# EAGLE design pump (EAGLE 9.0.1)
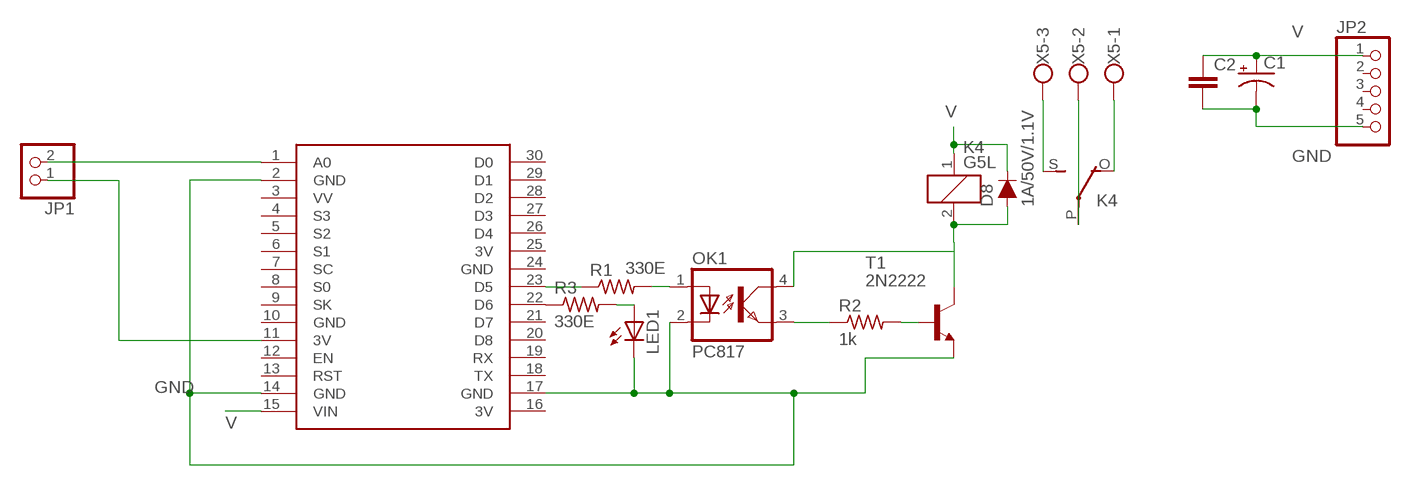
[diagram p0: schematic, sheet 1]

## Parts
C1  CPOL-USE5-5  [E5-5]
C2  C5/3  [C5B3]
D8  1A/50V/1.1V  DIODE-PTH  [DIODE-1N4001]
JP1  PINHD-1X2  [1X02]
JP2  PINHD-1X5  [1X05]
K4  G5L  [G5LE]
LED1  LED5MM  [LED5MM]
OK1  PC817  [DIL04]
R1  330E  R-US_0204/7  [0204/7]
R2  1k  R-US_0207/7  [0207/7]
R3  330E  R-US_0204/7  [0204/7]
T1  2N2222  [TO92-EBC-OVAL]
U$1  NODEMCU  [NODEMCU]
X5  W237-103  [W237-103]

## Nets
GND: C1.- C2.2 JP2.5 LED1.K(C) OK1.2(C) T1.E U$1.2(GND) U$1.14(GND) U$1.17(GND)
N$1: R1.1 U$1.23(D5)
N$2: OK1.1(A) R1.2
N$3: OK1.3(EMIT) R2.1
N$4: R2.2 T1.B
N$5: LED1.A R3.2
N$6: JP1.2 U$1.1(A0)
N$7: JP1.1 U$1.11(3V)
N$8: R3.1 U$1.22(D6)
N$39: K4.S(2:S) X5.3
N$40: K4.O(2:O) X5.1
N$41: K4.P(2:P) X5.2
N$42: D8.A K4.2 OK1.4(COL) T1.C
V: C1.+ C2.1 D8.C JP2.1 K4.1 U$1.15(VIN)
Unconnected: JP2.2 JP2.3 JP2.4 U$1.3(VV) U$1.4(S3) U$1.5(S2) U$1.6(S1) U$1.7(SC) U$1.8(S0) U$1.9(SK) U$1.12(EN) U$1.13(RST) U$1.18(TX) U$1.19(RX) U$1.20(D8) U$1.21(D7) U$1.26(D4) U$1.27(D3) U$1.28(D2) U$1.29(D1) U$1.30(D0)

## Power pins joined to a net without a drawn wire
3V: U$1.16(3V) U$1.25(3V)
GND: U$1.10(GND) U$1.24(GND)

## Library data of the parts
C1 = adafruit:CPOL-US: POLARIZED CAPACITOR, American symbol
C2 = capacitor-wima:C: CAPACITOR naming: grid - package width
D8 = SparkFun-DiscreteSemi:DIODE: Diode These are standard reverse protection diodes and small signal diodes. SparkFun Products: SparkFun SparkPunk Sound Kit <https://www.sparkfun.com/products/11177> SparkFun ESP8266 Thing <https://www.sparkfun.com/products/13231>; PROD_ID: DIO-09176
JP1 = DC_LOAD_AU:PINHD-1X2: PIN HEADER
JP2 = pinhead:PINHD-1X5: PIN HEADER
K4 = relay:G5L: RELAY 1 x switch, 10 A/120 V AC, 8 A/30 V ADC, Omron; OC_FARNELL: unknown; OC_NEWARK: unknown
LED1 = adafruit:LED: LED OSRAM: - CHIPLED LG R971, LG N971, LY N971, LG Q971, LY Q971, LO R971, LY R971 LH N974, LH R974 LS Q976, LO Q976, LY Q976 LO Q996 - Hyper CHIPLED LW Q18S LB Q993, LB Q99A, LB R99A - SideLED LS A670, LO A670, LY A670, LG A670, LP A670 LB A673, LV A673, LT A673, LW A673 LH A674 LY A675 LS A676, LA A676, LO A676, LY A676, LW A676 LS A679, LY A679, LG A679 - Hyper Micro SIDELED® LS Y876, LA Y876, LO Y876, LY Y876 LT Y87S - SmartLED LW L88C, LW L88S LB L89C, LB L89S, LG L890 LS L89K, LO L89K, LY L89K LS L896, LA L896, LO L896, LY L896 - TOPLED LS T670, LO T670, LY T670, LG T670, LP T670 LSG T670, LSP T670, LSY T670, LOP T670, LYG T670 LG T671, LOG T671, LSG T671 LB T673, LV T673, LT T673, LW T673 LH T674 LS T676, LA T676, LO T676, LY T676, LB T676, LH T676, LSB T676, LW T676 LB T67C, LV T67C, LT T67C, LS T67K, LO T67K, LY T67K, LW E67C LS E67B, LA E67B, LO E67B, LY E67B, LB E67C, LV E67C, LT E67C LW T67C LS T679, LY T679, LG T679 LS T770, LO T770, LY T770, LG T770, LP T770 LB T773, LV T773, LT T773, LW T773 LH T774 LS E675, LA E675, LY E675, LS T675 LS T776, LA T776, LO T776, LY T776, LB T776 LHGB T686 LT T68C, LB T68C - Hyper Mini TOPLED® LB M676 - Mini TOPLED Santana® LG M470 LS M47K, LO M47K, LY M47K Source: http://www.osram.convergy.de/
OK1 = optocoupler:PC817: SHARP OPTO COUPLER; MPN: PC817X4J000F; OC_FARNELL: 9707727; OC_NEWARK: 97K7059
R1-R3 = adafruit:R-US_: RESISTOR, American symbol
T1 = adafruit:2N2222: NPN TRANSISTOR Big oval pads
U$1 = nodemcu:NODEMCU
X5 = con-wago-500:W237-103: WAGO SCREW CLAMP; MPN: 237-103; OC_FARNELL: unknown; OC_NEWARK: 18M7116

## Board
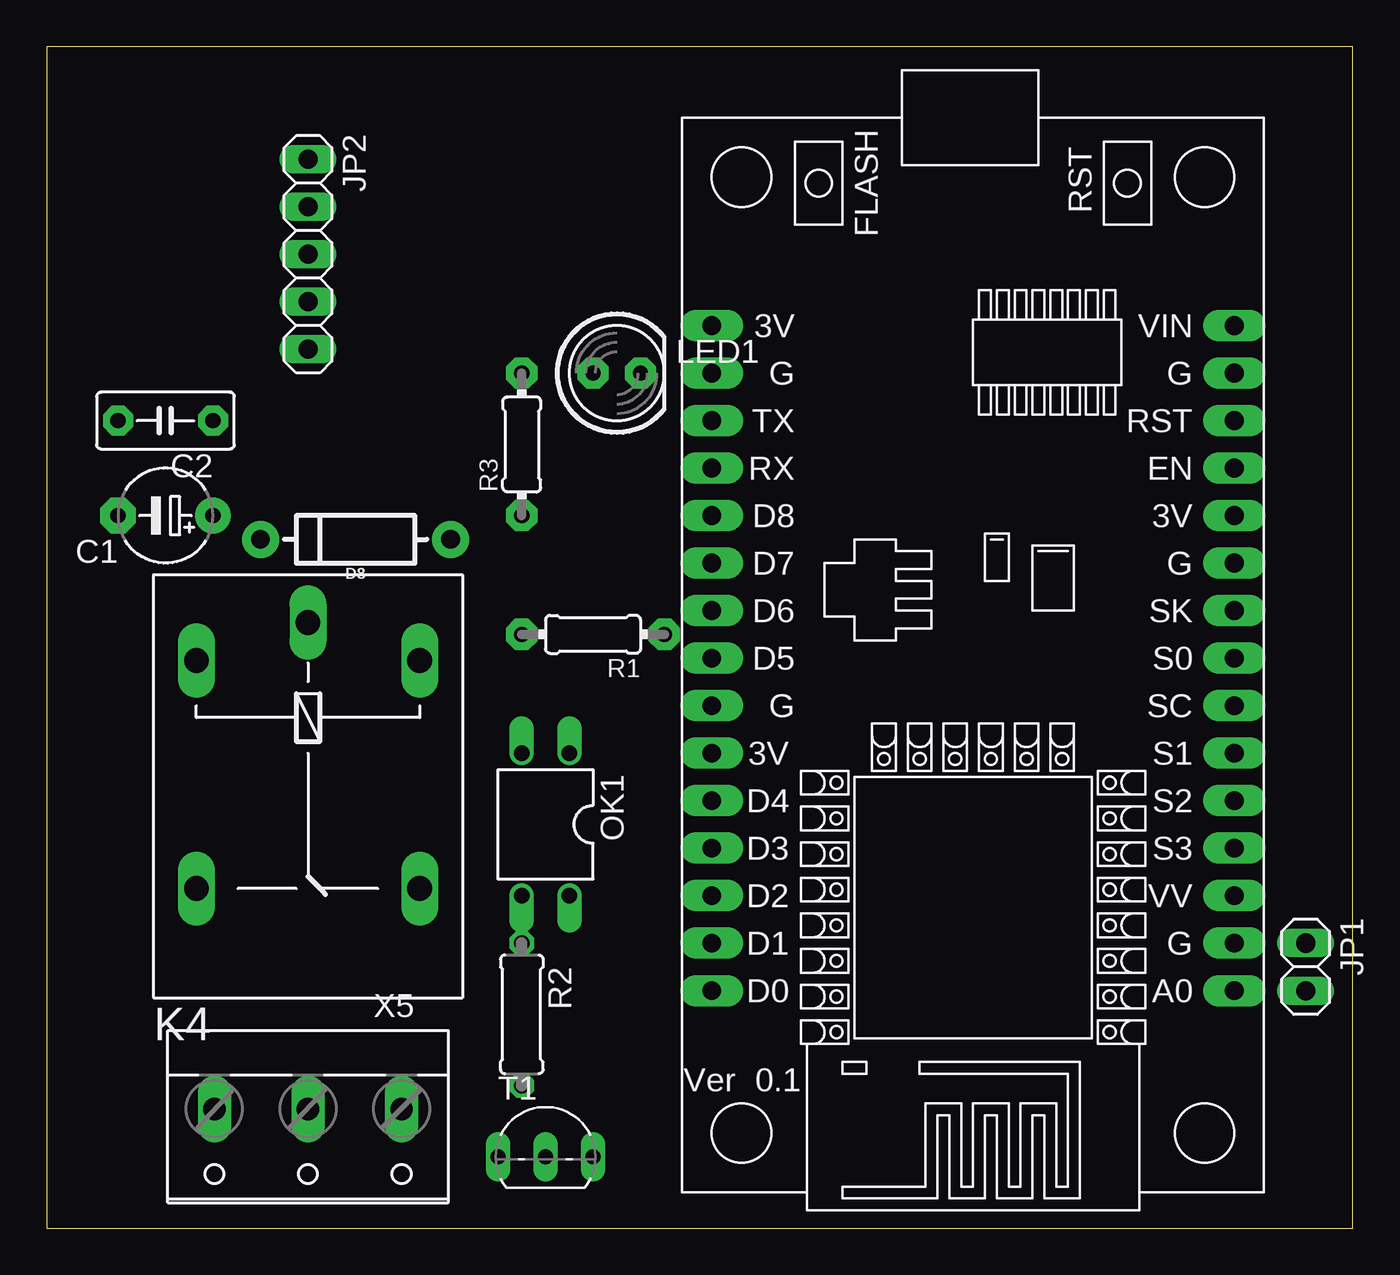
[diagram p1: board, top side]
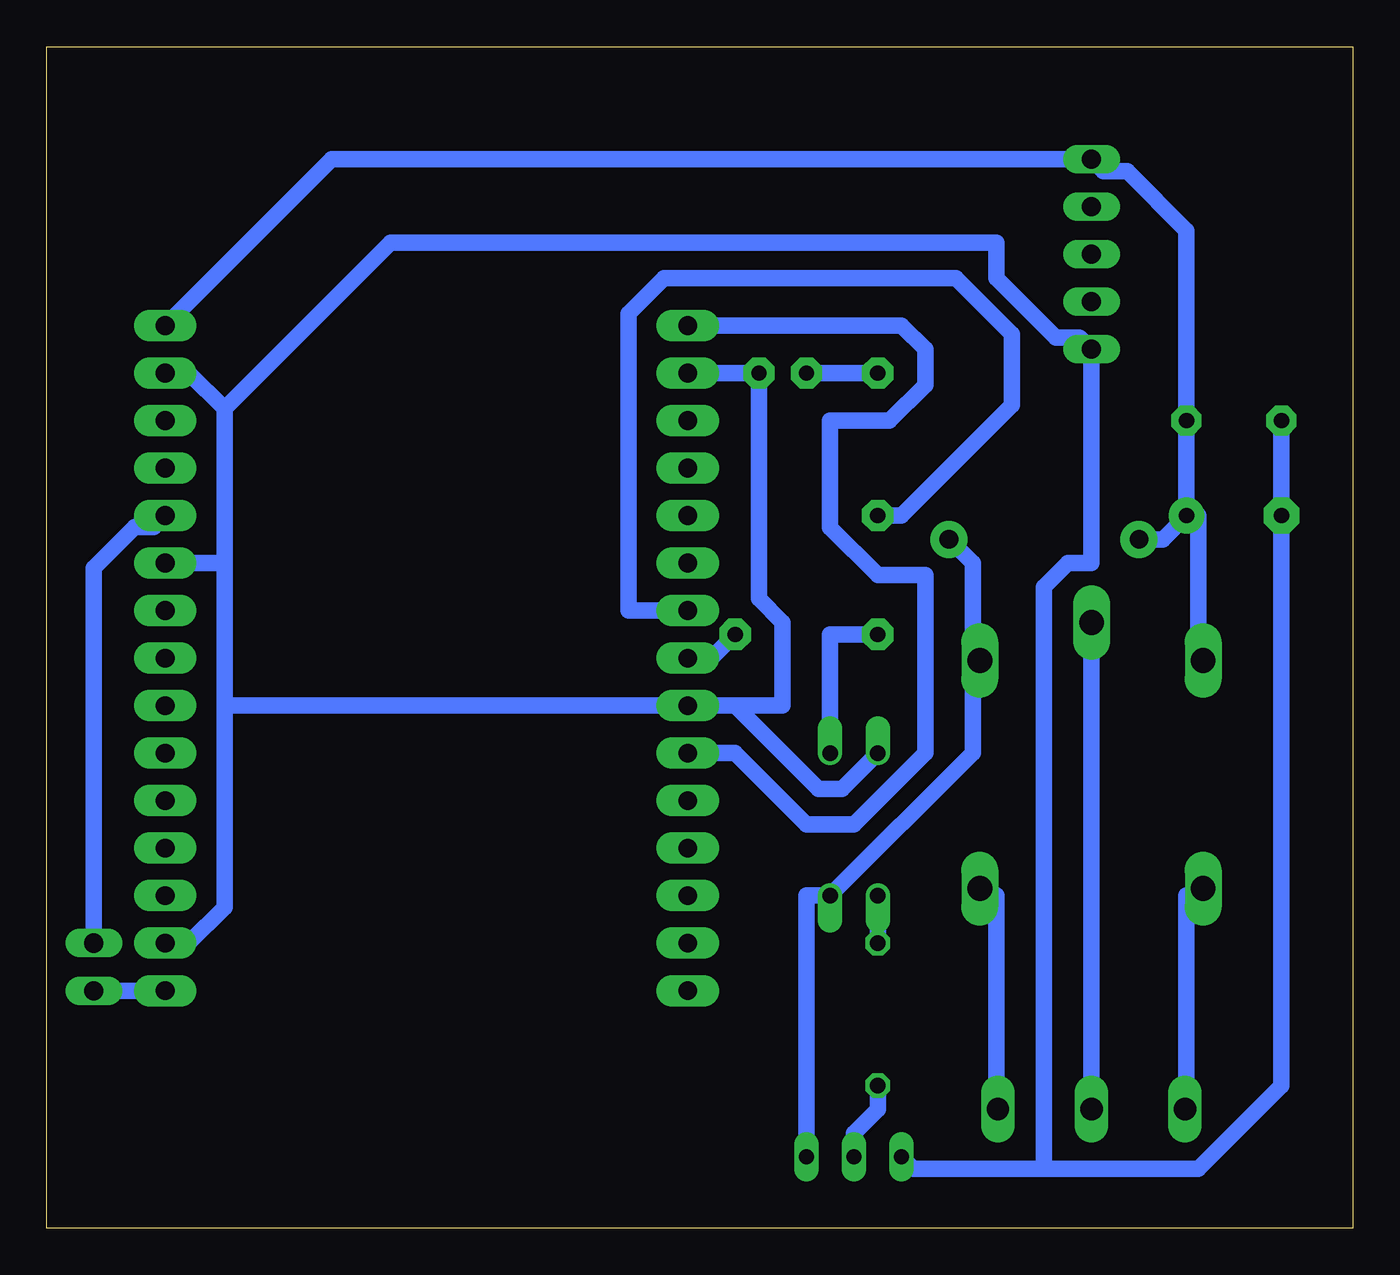
[diagram p2: board, bottom side, seen from below]

Size 69.83 x 63.17 mm. Coordinates in mm from the lower left corner, seen from the top.
Outline: 0,0 69.83,0 69.83,63.17 0,63.17 0,0
Copper layers (1*16): Top 0.035mm / dielectric 1.5mm / Bottom 0.035mm
Design rules "default *": minimum track width 35mil, minimum drill 0.35mm, track to track 25mil, track to pad 25mil, pad to pad 25mil, via to via 6mil, smd to smd 6mil, copper to edge 40mil, drill to drill 6mil, minimum pad ring 10mil, minimum via ring 8mil, stop-mask expansion 4mil, vias tented up to drill 0mil, thermal gap 10mil

### Footprints (pad centres in the part's own frame; a part is rotated, then mirrored left to right if it is on the bottom)
E5-5 = drill 0.813 pad 1.905: + -2.54,0 | drill 0.813 pad 1.905 octagon: - 2.54,0
C5B3 = drill 0.813 pad 1.6 octagon: 1 -2.54,0; 2 2.54,0
DIODE-1N4001 = drill 1 pad 1.981: A -5.08,0; C 5.08,0
1X02 = drill 1.016 long: 1 -1.27,0; 2 1.27,0
1X05 = drill 1.016 long: 1 -5.08,0; 2 -2.54,0; 3 0,0; 4 2.54,0; 5 5.08,0
G5LE = drill 1.321 long: 1 -7.493,-5.969; 2 -7.493,5.969; O 4.699,5.969; P -9.525,0; S 4.699,-5.969
LED5MM = drill 0.813 pad 1.676 octagon: A -1.27,0; K 1.27,0
DIL04 = drill 0.813 offset: 1 -1.27,-3.81; 2 1.27,-3.81; 3 1.27,3.81; 4 -1.27,3.81
0204/7 = drill 0.813 pad 1.676 octagon: 1 -3.81,0; 2 3.81,0
0207/7 = drill 0.813 octagon: 1 -3.81,0; 2 3.81,0
TO92-EBC-OVAL = drill 0.813 long: B 0,-1.27; C 2.54,-1.27; E -2.54,-1.27
NODEMCU = drill 1 pad 1.676 long: 1 -13.97,17.78; 2 -13.97,15.24; 3 -13.97,12.7; 4 -13.97,10.16; 5 -13.97,7.62; 6 -13.97,5.08; 7 -13.97,2.54; 8 -13.97,0; 9 -13.97,-2.54; 10 -13.97,-5.08; 11 -13.97,-7.62; 12 -13.97,-10.16; 13 -13.97,-12.7; 14 -13.97,-15.24; 15 -13.97,-17.78; 16 13.97,-17.78; 17 13.97,-15.24; 18 13.97,-12.7; 19 13.97,-10.16; 20 13.97,-7.62; 21 13.97,-5.08; 22 13.97,-2.54; 23 13.97,0; 24 13.97,2.54; 25 13.97,5.08; 26 13.97,7.62; 27 13.97,10.16; 28 13.97,12.7; 29 13.97,15.24; 30 13.97,17.78
W237-103 = drill 1.194 long: 1 -5,-1.29; 2 0,-1.29; 3 5,-1.29

### Placement (x,y rotation side)
C1  6.35,38.1 180 top
C2  6.35,43.18 180 top
D8  16.51,36.83 180 top
JP1  67.31,13.97 270 top
JP2  13.97,52.07 270 top
K4  13.97,22.86 270 top
LED1  30.48,45.72 0 top
OK1  26.67,21.59 180 top
R1  29.21,31.75 180 top
R2  25.4,11.43 270 top
R3  25.4,41.91 90 top
T1  26.67,5.08 0 top
U$1  49.53,30.48 180 top
X5  13.97,5.08 180 top

### Tracks (layer width: path | path; a pad name or v marks a point on that pad's centre or on a via)
3V
  Bottom 0.889: U$1.25 33.02,25.4 29.21,21.59 26.67,21.59 22.86,25.4 22.86,34.92 25.4,34.92 27.94,37.47 27.94,43.18 24.77,43.18 22.86,45.09 22.86,46.99 24.13,48.26 U$1.16
GND
  Bottom 0.889: T1.E 23.5,3.17 16.51,3.17 | 16.51,3.17 8.26,3.17 3.81,7.62 C1.- C2.2 | 16.51,3.17 16.51,34.29 15.24,35.56 13.97,35.56 JP2.5 14.61,47.62 15.88,47.62 19.05,50.8 19.05,52.7 51.44,52.7 60.33,43.81 | U$1.17 LED1.K 31.75,33.66 30.48,32.38 30.48,27.94 33.02,27.94 | OK1.2 27.3,23.5 28.57,23.5 33.02,27.94 | 33.02,27.94 U$1.24 60.33,27.94 | U$1.2 62.23,15.24 60.33,17.14 60.33,27.94 | 60.33,35.56 60.33,27.94 | U$1.10 60.33,35.56 | U$1.14 62.23,45.72 60.33,43.81 | 60.33,35.56 60.33,43.81
N$1
  Bottom 0.889: R1.1 34.29,30.48 U$1.23
N$2
  Bottom 0.889: OK1.1 27.94,31.75 R1.2
N$3
  Bottom 0.889: OK1.3 R2.1
N$4
  Bottom 0.889: T1.B 26.67,5.08 25.4,6.35 R2.2
N$5
  Bottom 0.889: LED1.A R3.2
N$6
  Bottom 0.889: U$1.1 JP1.2
N$7
  Bottom 0.889: U$1.11 64.12,37.48 65.13,37.48 67.31,35.3 JP1.1
N$8
  Bottom 0.889: U$1.22 38.73,33.02 38.73,48.9 36.83,50.8 21.2,50.8 18.22,47.82 18.22,44.01 24.13,38.1 R3.1
N$39
  Bottom 0.889: X5.3 8.89,6.99 8.89,17.78 8.26,17.78 K4.S
N$40
  Bottom 0.889: X5.1 19.05,6.99 19.05,17.78 19.68,17.78 K4.O
N$41
  Bottom 0.889: K4.P X5.2
N$42
  Bottom 0.889: T1.C 29.21,17.78 OK1.4 20.32,25.4 20.32,29.84 K4.2 20.32,30.48 20.32,35.56 D8.A
V
  Bottom 0.889: C1.+ 10.16,36.83 D8.C | C1.+ 8.26,38.1 8.26,30.48 K4.1 | U$1.15 54.61,57.15 JP2.1 13.34,56.52 12.06,56.52 8.89,53.34 C2.1 C1.+